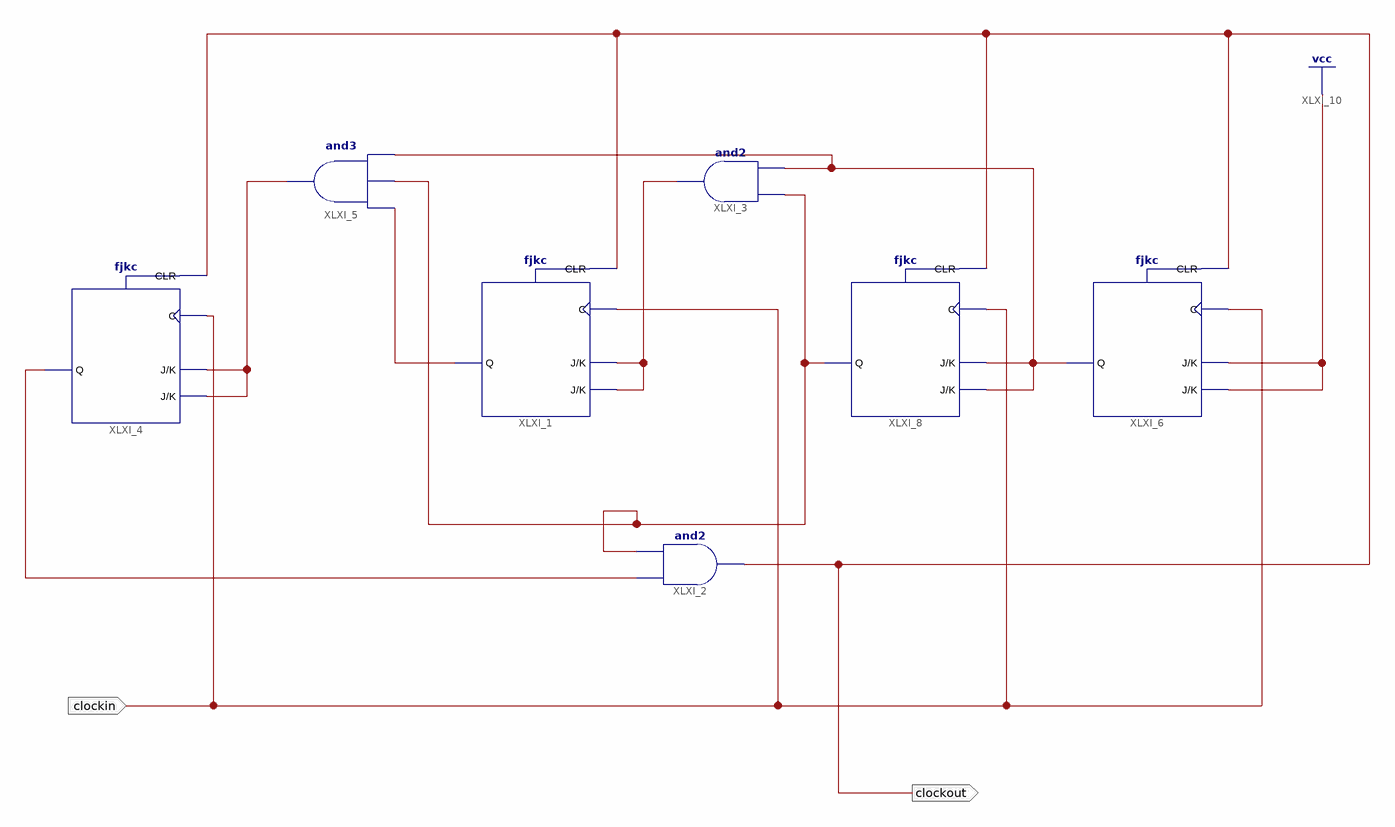
[diagram p0: schematic sheet 1]
// Xilinx ISE schematic div10.sch (spartan6) as structural Verilog: 7 symbols, 2 ports
module div10 (
  input  clockin,
  output clockout
);

  wire XLXN_2, XLXN_5, XLXN_6, XLXN_7, XLXN_9, XLXN_10;

  fjkc XLXI_1 (.C(clockin), .CLR(clockout), .J(XLXN_6), .K(XLXN_6), .Q(XLXN_7));
  and XLXI_2 (clockout, XLXN_10, XLXN_5);
  and XLXI_3 (XLXN_6, XLXN_2, XLXN_5);
  fjkc XLXI_4 (.C(clockin), .CLR(clockout), .J(XLXN_9), .K(XLXN_9), .Q(XLXN_10));
  and XLXI_5 (XLXN_9, XLXN_7, XLXN_5, XLXN_2);
  fjkc XLXI_6 (.C(clockin), .CLR(clockout), .J(1'b1), .K(1'b1), .Q(XLXN_2));
  fjkc XLXI_8 (.C(clockin), .CLR(clockout), .J(XLXN_2), .K(XLXN_2), .Q(XLXN_5));
endmodule
